# EAGLE design bgt-pwr-dist (EAGLE 7.7.0)
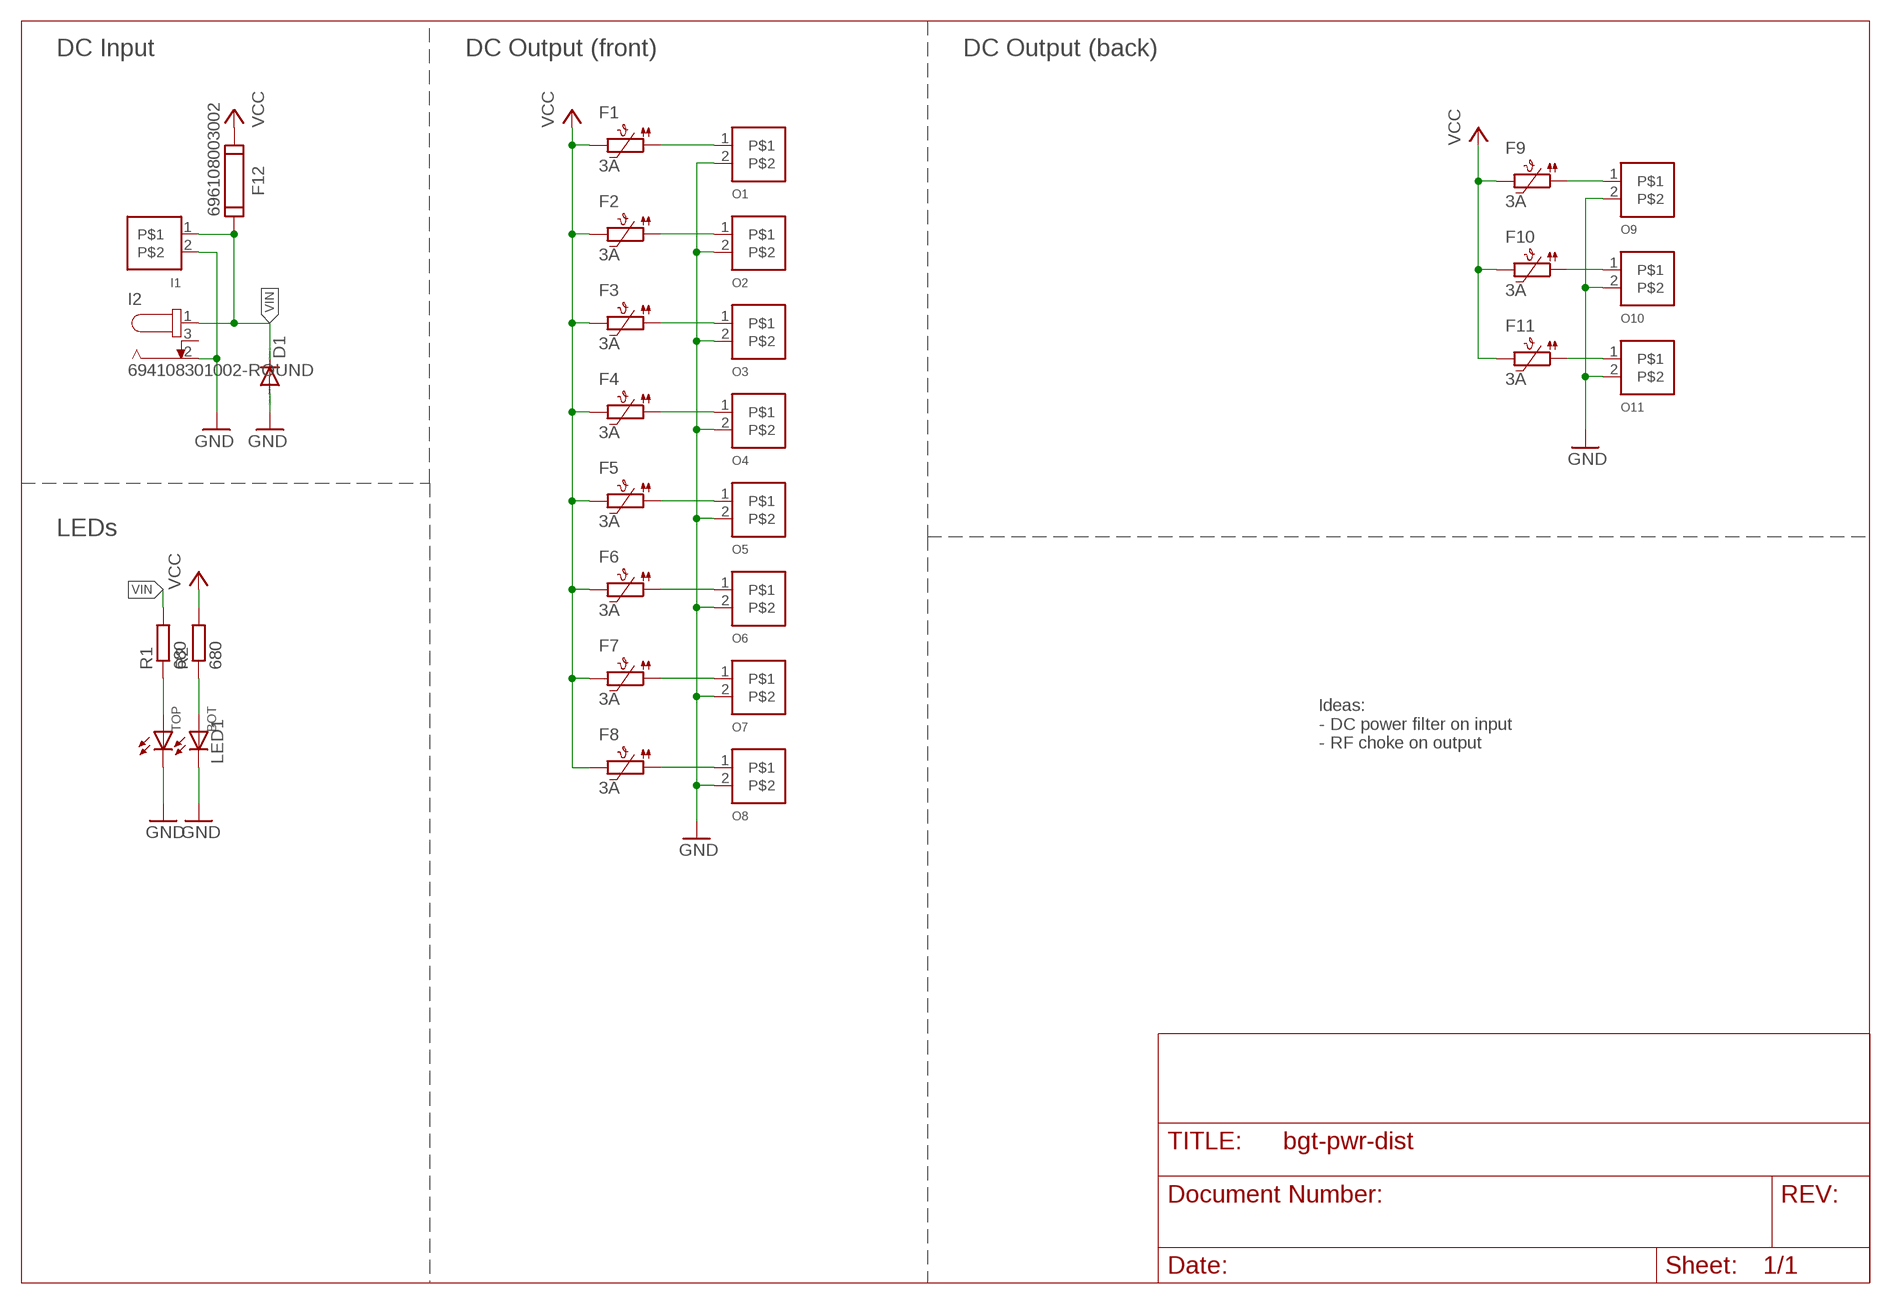
[diagram p0: schematic, sheet 1]

## Parts
D1  DIODE-DO201-15  [DO201-15]
F1  3A  POLYFUSE16R300G  [16R300G]
F2  3A  POLYFUSE16R300G  [16R300G]
F3  3A  POLYFUSE16R300G  [16R300G]
F4  3A  POLYFUSE16R300G  [16R300G]
F5  3A  POLYFUSE16R300G  [16R300G]
F6  3A  POLYFUSE16R300G  [16R300G]
F7  3A  POLYFUSE16R300G  [16R300G]
F8  3A  POLYFUSE16R300G  [16R300G]
F9  3A  POLYFUSE16R300G  [16R300G]
F10  3A  POLYFUSE16R300G  [16R300G]
F11  3A  POLYFUSE16R300G  [16R300G]
F12  696108003002  [696108003002]
I1  RIA_1X2-230  [RIA230]
I2  694108301002-ROUND  [694108301002_ROUND]
LED1  WP934MD  [T-1]
O1  RIA_1X2-382  [RIA382-02]
O2  RIA_1X2-382  [RIA382-02]
O3  RIA_1X2-382  [RIA382-02]
O4  RIA_1X2-382  [RIA382-02]
O5  RIA_1X2-382  [RIA382-02]
O6  RIA_1X2-382  [RIA382-02]
O7  RIA_1X2-382  [RIA382-02]
O8  RIA_1X2-382  [RIA382-02]
O9  RIA_1X2-382  [RIA382-02]
O10  RIA_1X2-382  [RIA382-02]
O11  RIA_1X2-382  [RIA382-02]
R1  680  R-EU_0207/10  [0207/10]
R2  680  R-EU_0207/10  [0207/10]

## Nets
GND: D1.A I1.2 I2.2 LED1.1(CT) LED1.3(CB) O1.2 O2.2 O3.2 O4.2 O5.2 O6.2 O7.2 O8.2 O9.2 O10.2 O11.2
N$1: F1.1 O1.1
N$3: F3.1 O3.1
N$4: F4.1 O4.1
N$5: F5.1 O5.1
N$6: F6.1 O6.1
N$7: F7.1 O7.1
N$8: F8.1 O8.1
N$10 [misc]: LED1.2(AT) R1.1
N$11: F9.1 O9.1
N$12: F10.1 O10.1
N$13: F11.1 O11.1
N$14 [misc]: LED1.4(AB) R2.1
O2: F2.1 O2.1
VCC: F1.2 F2.2 F3.2 F4.2 F5.2 F6.2 F7.2 F8.2 F9.2 F10.2 F11.2 F12.2 R2.2
VIN: D1.C F12.1 I1.1 I2.1 R1.2
Unconnected: I2.3

## Notes on the sheet
- DC Input | DC Output (front) | DC Output (back)
- LEDs
- Ideas:
  - DC power filter on input
  - RF choke on output

## Library data of the parts
D1 = diode:DIODE-: DIODE; CLASS: DIODE; DESCRIPTION: DIODE ZENER 14V 5W DO15; LINK: https://www.digikey.de/en/products/detail/micro-commercial-co/1N5351B-TP/1114220; MANUFACTURER: Micro Commercial Co; MANUFACTURERPARTNUMBER: 1N5351B; POPULATED: TRUE; ROHSCERTIFICATE: UNKNOWN ROHS CERTIFICATE; SOURCE: DIGIKEY; SOURCEPARTNUMBER: 1N5351BTPMSCT-ND
F1-F11 = littlefuse:POLYFUSE; CLASS: UNKNOWN CLASS; DESCRIPTION: PTC RESET FUSE 16V 3A RADIAL; LINK: https://www.digikey.de/en/products/detail/littelfuse-inc/16R300GPR/14324570; MANUFACTURER: LITTELFUSE; MANUFACTURERPARTNUMBER: 16R300GPR; POPULATED: TRUE; ROHSCERTIFICATE: UNKNOWN ROHS CERTIFICATE; SOURCE: DIGIKEY; SOURCEPARTNUMBER: 18-16R300GPRCT-ND
F12 = Wuerth_WR-FSH_rev20a:696108003002: WR-FSH Fuseholder THT Blocks PCB Clip Cover MATERIAL PROPERTIES Insulator Material PA66 Insulator Flammability Rating UL94 V-0 Insulator Color Green Contact Material Copper Alloy Contact Plating Tin over Nickel Contact Type Stamped GENERAL INFORMATION Operating Temperature -30 up to +120 °C Compliance RoHS ELECTRICAL PROPERTIES IR UL 20 A IR VDE 6.3 A Working Voltage [UL] 250 V (AC) Working Voltage [VDE] 250 V (AC) Withstanding Voltage [UL] 1500 V (AC) Withstanding Voltage [cULus] 1500 V (AC) Withstanding Voltage [VDE] 1500 V (AC) Contact Resistance 10 mΩ Contact Resistance [VDE] 10 mΩ MECHANICAL PROPERTIES Protection Class I & II Fuse Size 5x20 mm CERTIFICATION cULus Approval E157417 VDE Approval 129302 PACKAGING PROPERTIES Packaging Box <https://katalog.we-online.com/media/images/v2/o33102v209%20Family_WR-FSH_69610X003002.jpg> Details see: https://katalog.we-online.com/en/em/FSH_THT_PCB_CLIP_COVER_69610X003002 Updated by Ella Wu 2019-10-25 2019 (C) Wurth Elektronik; CLASS: UNKNOWN CLASS; DATASHEET-URL: https://www.we-online.com/catalog/datasheet/696108003002.pdf; DESCRIPTION: FUSEHOLDER BLOCKS - PCB - CLIP C; IR-UL: 20A; IR-VDE: 6.3A; LINK: https://www.digikey.de/en/products/detail/w%C3%BCrth-elektronik/696108003002/7244560; MANUFACTURER: Wuerth Elektronik; MANUFACTURERPARTNUMBER: 696108003002; MATES: 696122003001; PART-NUMBER: 696108003002; POPULATED: TRUE; ROHSCERTIFICATE: UNKNOWN ROHS CERTIFICATE; SOURCE: DIGIKEY; SOURCEPARTNUMBER: 732-11376-ND
I1 = RIA-PlugCon:RIA_1X2; CLASS: UNKNOWN CLASS; DESCRIPTION: NO DESCRIPTION; LINK: https://www.digikey.de/en/products/detail/cui-devices/TBP01R1-508-02BE/10238383; MANUFACTURER: CUI Devices; MANUFACTURERPARTNUMBER: TBP01R1-508-02BE; POPULATED: TRUE; ROHSCERTIFICATE: UNKNOWN ROHS CERTIFICATE; SOURCE: DIGIKEY; SOURCEPARTNUMBER: 102-6406-ND
I2 = Wurth_Elektronik_Electromechanic_DC_Power_Jack_Connectors_rev15c:694108301002: WR-DC_DC Power Jack_Right Angled_THT Center Pin Ø2.5_Plug ID Ø2.05_Plug OD Ø5.5 ;=>Code : Con_WR-DC_THT_694108301002_694108301002 <http://katalog.we-online.de/media/images/eican/Con_WR-DC_THT_694108301002_pf2.jpg> Details see: http://katalog.we-online.de/em/datasheet/6941xx301002.pdf Created 2014-10-08, Karrer Zheng 2014 (C) Wurth Elektronik; CLASS: UNKNOWN CLASS; DESCRIPTION: CONN PWR JACK 2.5X5.5MM SOLDER; LINK: https://www.digikey.de/en/products/detail/w%C3%BCrth-elektronik/694108301002/5047524; MANUFACTURER: Würth Elektronik; MANUFACTURERPARTNUMBER: 694108301002; POPULATED: TRUE; ROHSCERTIFICATE: UNKNOWN ROHS CERTIFICATE; SOURCE: DIGIKEY; SOURCEPARTNUMBER: 732-5934-ND
LED1 = led-dialight:WP934MD; CLASS: LED; DESCRIPTION: LED 3MM BI-LEVEL 565NM GRN DIFF; LINK: https://www.digikey.de/en/products/detail/kingbright/WP934MD-2GD/3084308; MANUFACTURER: Kingbright; MANUFACTURERPARTNUMBER: WP934MD/2GD; POPULATED: TRUE; ROHSCERTIFICATE: UNKNOWN ROHS CERTIFICATE; SOURCE: DIGIKEY; SOURCEPARTNUMBER: 754-1748-ND
O1-O11 = RIA-PlugCon:RIA_1X2; CLASS: UNKNOWN CLASS; DESCRIPTION: NO DESCRIPTION; LINK: https://www.digikey.de/en/products/detail/cui-devices/TBP02R1-381-02BE/10238457; MANUFACTURER: CUI DEVICES; MANUFACTURERPARTNUMBER: TBP02R1-381-02BE; POPULATED: TRUE; ROHSCERTIFICATE: UNKNOWN ROHS CERTIFICATE; SOURCE: DIGIKEY; SOURCEPARTNUMBER: 102-6480-ND
R1 R2 = resistor:R-EU_: RESISTOR, European symbol; CLASS: RESISTOR; DESCRIPTION: RES 680 OHM 5% 1/4W AXIAL; LINK: https://www.digikey.de/en/products/detail/stackpole-electronics-inc/CF14JT680R/1741489; MANUFACTURER: UNKNOWN MANUFACTURER; MANUFACTURERPARTNUMBER: CF14JT680R; POPULATED: TRUE; ROHSCERTIFICATE: Stackpole; SOURCE: DIGIKEY; SOURCEPARTNUMBER: CF14JT680RCT-ND

## Net classes
0 default: width 2 mm, clearance 0.5 mm

## Board
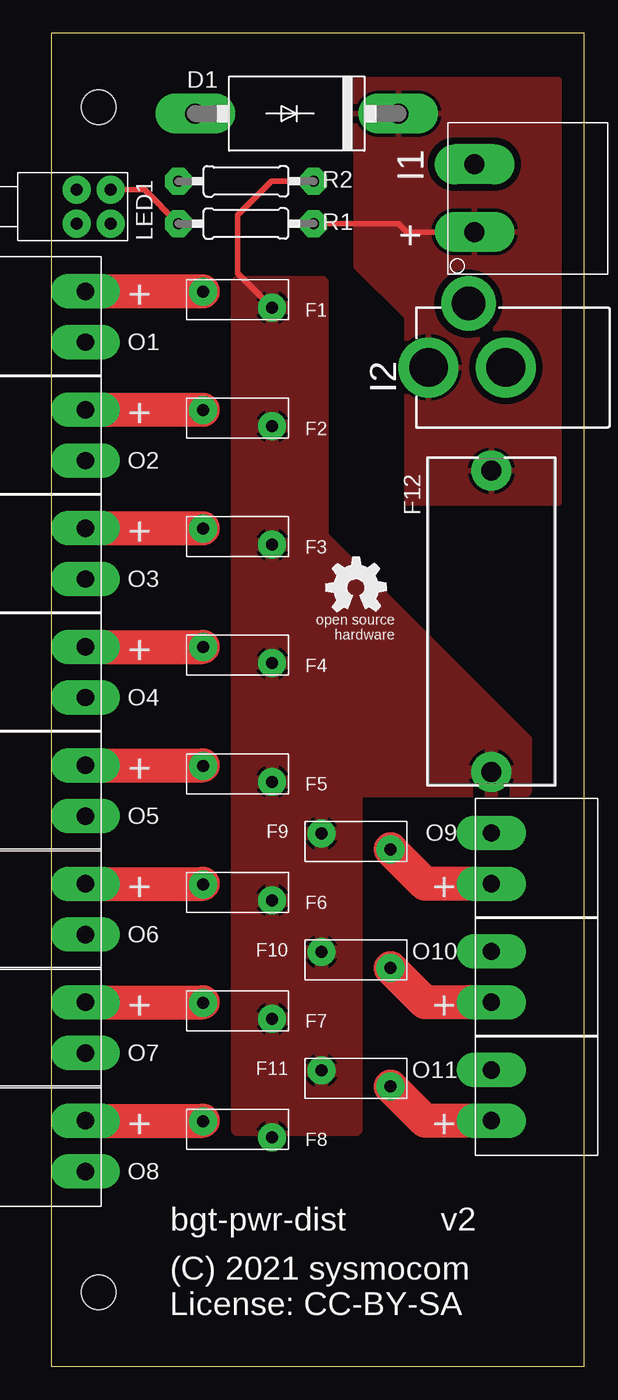
[diagram p1: board, top side]
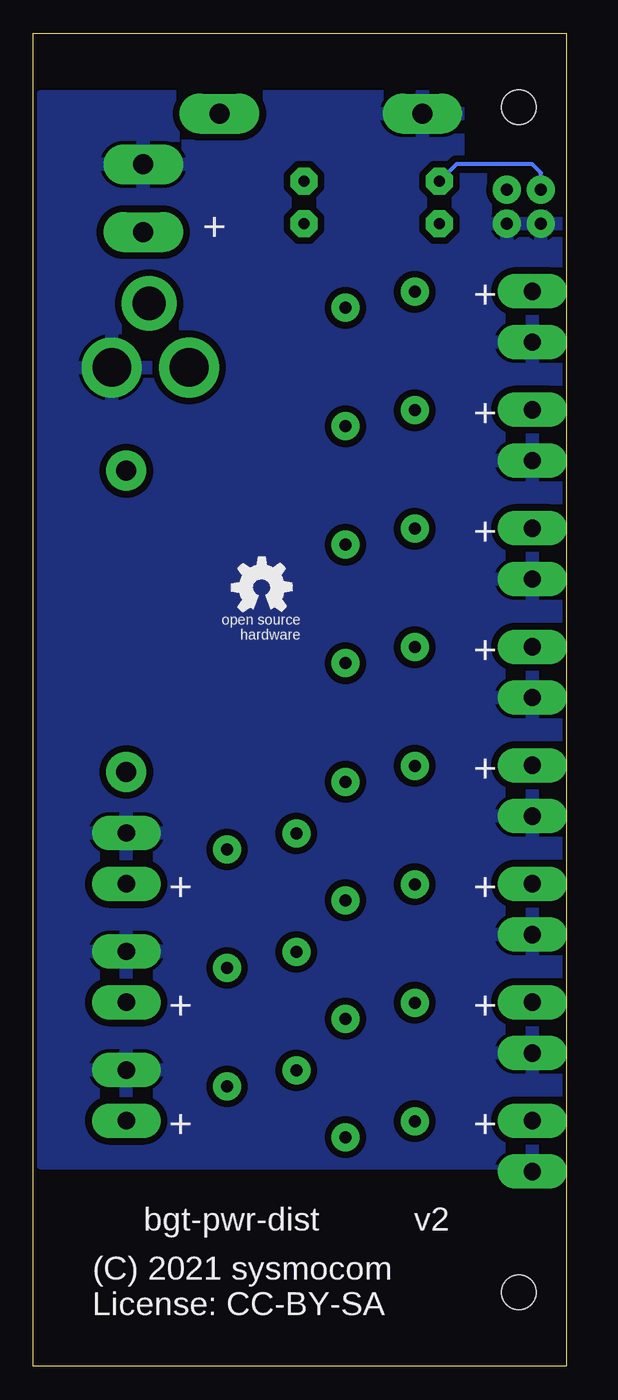
[diagram p2: board, bottom side, seen from below]

Size 40 x 100 mm. Coordinates in mm from the lower left corner, seen from the top.
Outline: 0,0 40,0 40,100 0,100 0,0
Copper layers (1*16): Top 0.035mm / dielectric 1.5mm / Bottom 0.035mm
Design rules "default *": minimum track width 0.2mm, minimum drill 0.3mm, track to track 0.15mm, track to pad 0.15mm, pad to pad 0.15mm, via to via 0.15mm, smd to smd 0.15mm, copper to edge 0.3mm, drill to drill 0.3mm, minimum pad ring 0.6mm, minimum via ring 8mil, stop-mask expansion 4mil, vias tented up to drill 0mil, thermal gap 10mil

### Footprints (pad centres in the part's own frame; a part is rotated, then mirrored left to right if it is on the bottom)
DO201-15 = drill 1.499 long: A 7.62,0; C -7.62,0
16R300G = drill 0.9: 1 -2.6,0.6; 2 2.6,-0.6
696108003002 = drill 1.5: 1 -11.3,0; 2 11.3,0
RIA230 = drill 1.5 long: 1 -2.54,0; 2 2.54,0
694108301002_ROUND = drill 2.9: 1 -13.6,0; 2 -7.8,0 | drill 2.5: 3 -10.6,4.8
T-1 = drill 0.9: 1 2.54,-1.27; 2 2.54,1.27; 3 0,-1.27; 4 0,1.27
RIA382-02 = drill 1.3 long: 1 -1.905,0; 2 1.905,0
0207/10 = drill 0.813 octagon: 1 -5.08,0; 2 5.08,0
BGT_3U_160 = hole 2.6: 3.56,94.45; 3.56,5.55

### Placement (x,y rotation side)
D1  18.41,93.98 180 top
F1  13.97,80.01 0 top
F2  13.97,71.12 0 top
F3  13.97,62.23 0 top
F4  13.97,53.34 0 top
F5  13.97,44.45 0 top
F6  13.97,35.56 0 top
F7  13.97,26.67 0 top
F8  13.97,17.78 0 top
F9  22.86,39.37 180 top
F10  22.86,30.48 180 top
F11  22.86,21.59 180 top
F12  33.02,55.88 270 top
I1  31.75,87.63 90 top
I2  41.91,74.93 0 top
LED1  1.91,87 0 top
O1  2.54,78.74 270 top
O2  2.54,69.85 270 top
O3  2.54,60.96 270 top
O4  2.54,52.07 270 top
O5  2.54,43.18 270 top
O6  2.54,34.29 270 top
O7  2.54,25.4 270 top
O8  2.54,16.51 270 top
O9  33.02,38.1 90 top
O10  33.02,29.21 90 top
O11  33.02,20.32 90 top
R1  14.61,85.72 0 top
R2  14.61,88.9 0 top
U$1  [BGT_3U_160]  0,0 0 top
U$2  [OSHW_5MM]  22.86,58.42 0 top
U$3  [OSHW_5MM]  22.86,58.42 0 bottom

### Tracks (layer width: path | path; a pad name or v marks a point on that pad's centre or on a via)
GND
  pour Bottom: 0,95.25 39.37,95.25 39.37,15.24 0,15.24
N$1
  Top 2: 11.37,80.64 F1.1
  Top 2.54: O1.1 11.37,80.64
N$3
  Top 2: 11.37,62.87 F3.1
  Top 2.54: O3.1 11.37,62.87
N$4
  Top 2: 11.37,53.98 F4.1
  Top 2.54: O4.1 11.37,53.98
N$5
  Top 2: 11.37,45.09 F5.1
  Top 2.54: O5.1 11.37,45.09
N$6
  Top 2: 11.37,36.2 F6.1
  Top 2.54: O6.1 11.37,36.2
N$7
  Top 2: 11.37,27.3 F7.1
  Top 2.54: O7.1 11.37,27.3
N$8
  Top 2: 11.37,18.41 F8.1
  Top 2.54: O8.1 11.37,18.41
N$10
  Top 0.406: LED1.2 6.99,88.27 R1.1
N$11
  Top 2.54: O9.1 28.04,36.2 F9.1
N$12
  Top 2.54: O10.1 28.04,27.3 F10.1
N$13
  Top 2.54: O11.1 28.04,18.41 F11.1
N$14
  Bottom 0.305: LED1.4 1.91,89.53 2.54,90.17 8.26,90.17 R2.1
O2
  Top 2: 11.37,71.75 F2.1
  Top 2.54: O2.1 11.37,71.75
VCC
  Top 0.406: R2.2 16.51,88.9 13.97,86.36 13.97,82.01 F1.2
  pour Top: 13.97,81.28 20.32,81.28 20.32,62.23 35.56,46.99 35.56,43.18 22.86,43.18 22.86,17.78 13.97,17.78
VIN
  Top 0.406: R1.2 26.04,85.72 26.67,85.09 I1.1
  pour Top: 22.86,96.52 22.86,82.55 26.67,78.74 26.67,64.77 38.1,64.77 38.1,96.52

### Text on the board
tNames: + | + | + | + | + | + | + | + | + | + | + | + | bgt-pwr-dist | (C) 2021 sysmocom / License: CC-BY-SA
bNames: + | + | + | + | + | + | + | + | + | + | + | + | bgt-pwr-dist | (C) 2021 sysmocom / License: CC-BY-SA